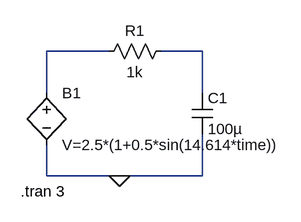
[diagram p0: schematic LTSpice_schematic_single_sine.asc]
LTSpice_schematic_single_sine.asc, the LTspice schematic file:
Version 4.1
SHEET 1 880 680
WIRE 192 96 96 96
WIRE 336 96 272 96
WIRE 96 160 96 96
WIRE 336 160 336 96
WIRE 96 288 96 240
WIRE 208 288 96 288
WIRE 336 288 336 224
WIRE 336 288 208 288
FLAG 208 288 0
SYMBOL bv 96 144 R0
SYMATTR InstName B1
SYMATTR Value V=2.5*(1+0.5*sin(14.614*time))
SYMBOL res 288 80 R90
WINDOW 0 0 56 VBottom 2
WINDOW 3 32 56 VTop 2
SYMATTR InstName R1
SYMATTR Value 1k
SYMBOL cap 320 160 R0
SYMATTR InstName C1
SYMATTR Value 100µ
TEXT 56 312 Left 2 !.tran 3

The netlist it stands for:
* LTSpice_schematic_single_sine.asc
B1 N001 0 V=2.5*(1+0.5*sin(14.614*time))
R1 N002 N001 1k
C1 N002 0 100µ
.tran 3
.backanno
.end